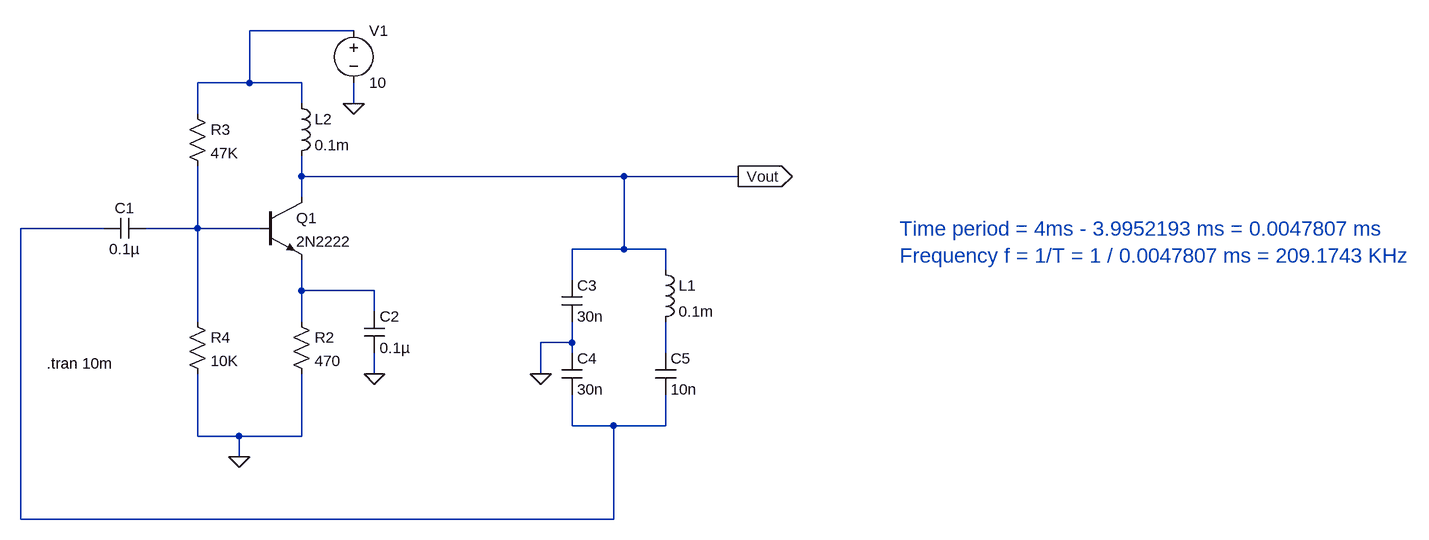
[diagram p0: schematic Clapp_OSC.asc]
Clapp_OSC.asc, the LTspice schematic file:
Version 4
SHEET 1 2056 680
WIRE 352 -128 192 -128
WIRE 192 -48 192 -128
WIRE 192 -48 112 -48
WIRE 272 -48 192 -48
WIRE 272 -16 272 -48
WIRE 352 -16 352 -48
WIRE 112 0 112 -48
WIRE 272 96 272 64
WIRE 768 96 272 96
WIRE 944 96 768 96
WIRE 272 128 272 96
WIRE -32 176 -160 176
WIRE 112 176 112 80
WIRE 112 176 32 176
WIRE 208 176 112 176
WIRE 768 208 768 96
WIRE 768 208 688 208
WIRE 832 208 768 208
WIRE 832 240 832 208
WIRE 688 256 688 208
WIRE 272 272 272 224
WIRE 384 272 272 272
WIRE 384 304 384 272
WIRE 112 320 112 176
WIRE 272 320 272 272
WIRE 688 352 688 320
WIRE 688 352 640 352
WIRE 688 368 688 352
WIRE 832 368 832 320
WIRE 384 400 384 368
WIRE 640 400 640 352
WIRE 688 480 688 432
WIRE 752 480 688 480
WIRE 832 480 832 432
WIRE 832 480 752 480
WIRE 112 496 112 400
WIRE 176 496 112 496
WIRE 272 496 272 400
WIRE 272 496 176 496
WIRE 176 528 176 496
WIRE -160 624 -160 176
WIRE 752 624 752 480
WIRE 752 624 -160 624
FLAG 352 -16 0
FLAG 176 528 0
FLAG 384 400 0
FLAG 640 400 0
FLAG 944 96 Vout
IOPIN 944 96 Out
SYMBOL npn 208 128 R0
SYMATTR InstName Q1
SYMATTR Value 2N2222
SYMBOL res 256 304 R0
SYMATTR InstName R2
SYMATTR Value 470
SYMBOL res 96 -16 R0
SYMATTR InstName R3
SYMATTR Value 47K
SYMBOL voltage 352 -144 R0
WINDOW 123 0 0 Left 0
WINDOW 39 0 0 Left 0
SYMATTR InstName V1
SYMATTR Value 10
SYMBOL res 96 304 R0
SYMATTR InstName R4
SYMATTR Value 10K
SYMBOL cap 32 160 R90
WINDOW 0 0 32 VBottom 2
WINDOW 3 32 32 VTop 2
SYMATTR InstName C1
SYMATTR Value 0.1µ
SYMBOL cap 368 304 R0
SYMATTR InstName C2
SYMATTR Value 0.1µ
SYMBOL cap 672 256 R0
SYMATTR InstName C3
SYMATTR Value 30n
SYMBOL cap 672 368 R0
SYMATTR InstName C4
SYMATTR Value 30n
SYMBOL ind 816 224 R0
SYMATTR InstName L1
SYMATTR Value 0.1m
SYMBOL cap 816 368 R0
SYMATTR InstName C5
SYMATTR Value 10n
SYMBOL ind 256 -32 R0
SYMATTR InstName L2
SYMATTR Value 0.1m
TEXT -120 384 Left 2 !.tran 10m
TEXT 1192 176 Left 3 ;Time period = 4ms - 3.9952193 ms = 0.0047807 ms\nFrequency f = 1/T = 1 / 0.0047807 ms = 209.1743 KHz

The netlist it stands for:
* Clapp_OSC.asc
Q1 Vout N003 N004 0 2N2222
R2 N004 0 470
R3 N001 N003 47K
V1 N001 0 10
R4 N003 0 10K
C1 N003 N002 0.1µ
C2 N004 0 0.1µ
C3 Vout 0 30n
C4 0 N002 30n
L1 Vout N005 0.1m
C5 N005 N002 10n
L2 N001 Vout 0.1m
.model NPN NPN
.model PNP PNP
.lib standard.bjt
.tran 10m
* Time period = 4ms - 3.9952193 ms = 0.0047807 ms
* Frequency f = 1/T = 1 / 0.0047807 ms = 209.1743 KHz
.backanno
.end